# Altium project DMPro16.PrjPcb (part 3 of 3)
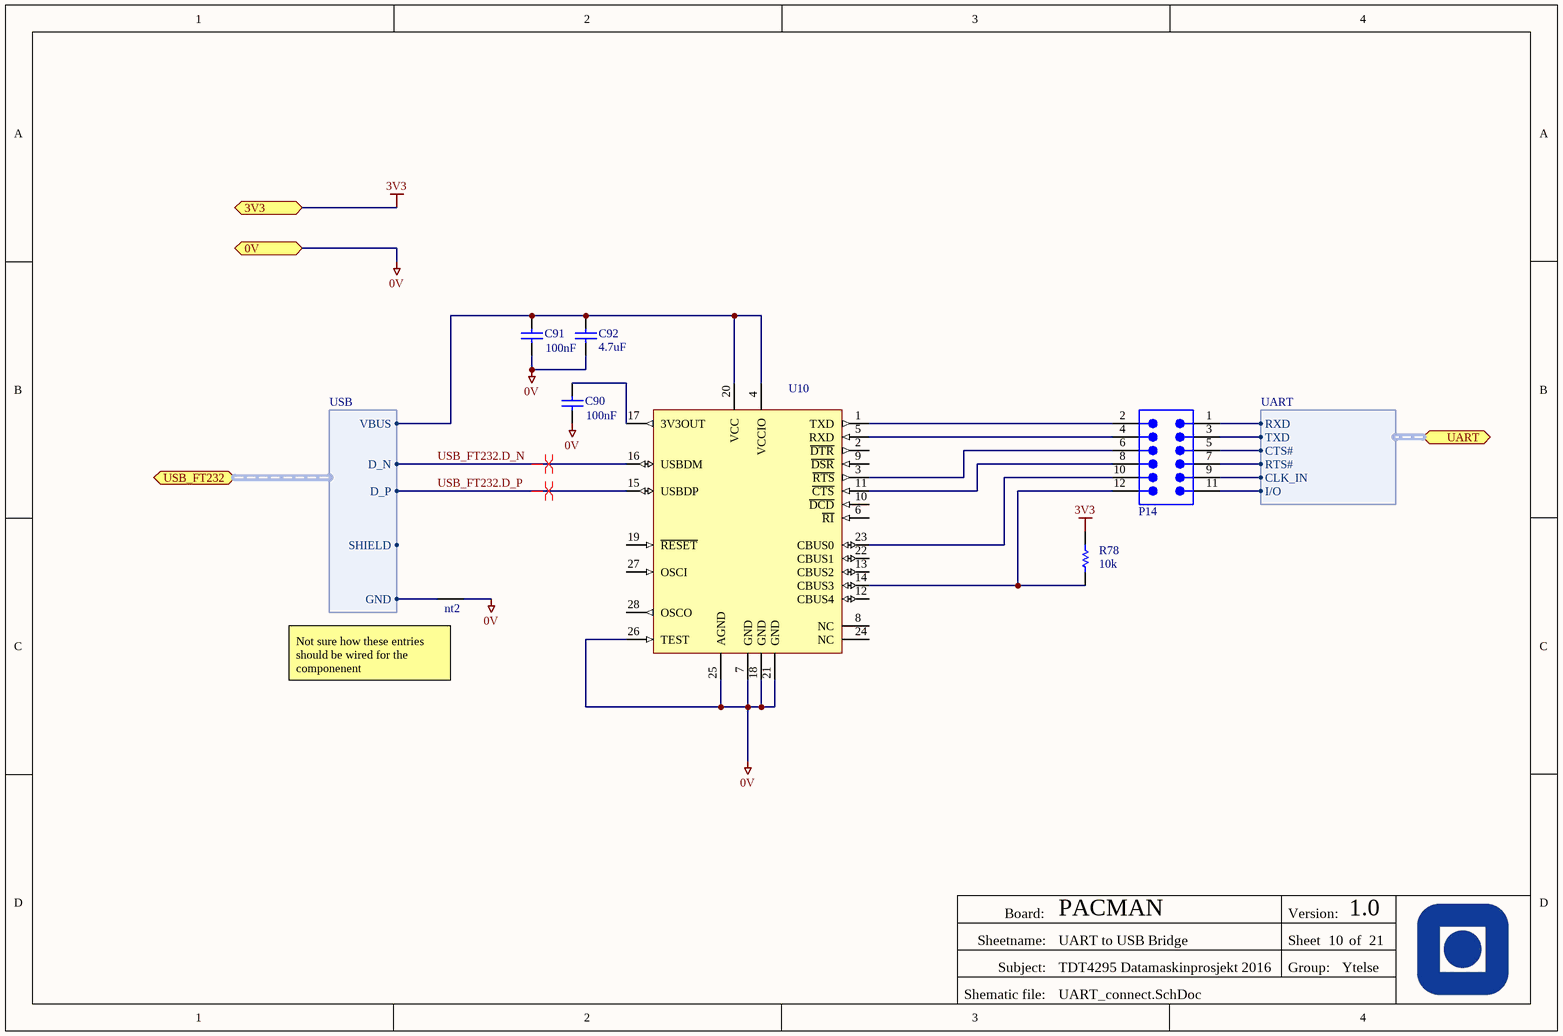
[diagram p21: UART_connect.SchDoc]

## Nets that join several sheets
0V: EFM32_power (24 pins), EFM32_IO (15 pins), XC7A35TFTG256_power (76 pins), XC7A35TFTG256_bank14 (C89.1 R59.2 SW4.1), XC7A35TFTG256_bank0 (19 pins), XC7A35TFTG256_bank15 (P13.11 P13.12), XC7A35TFTG256_bank35 (C41.1 C42.1 OSC3.2), SDtop (6 pins), Power (25 pins), N25Q128A13ESE40 (C17.1 U2.4), USB3300 (18 pins), LED (5 pins), Connectors (D5.2 J6.5 P7.1), USB_trans (C87.1 P20.2 U9.7), UART_connect (9 pins)
1V: XC7A35TFTG256_power (14 pins), Power (5 pins)
1V8: XC7A35TFTG256_power (12 pins), Power (5 pins)
3V3: EFM32_power (21 pins), EFM32_IO (C1.2 OSC1.1 OSC1.4 P1.1), XC7A35TFTG256_power (51 pins), XC7A35TFTG256_bank14 (R58.1 R73.2), XC7A35TFTG256_bank0 (13 pins), XC7A35TFTG256_bank35 (C41.2 OSC3.4), SDtop (9 pins), Power (5 pins), N25Q128A13ESE40 (6 pins), USB3300 (11 pins), LED (P21.3), USB_trans (C87.2 U9.1 U9.12 U9.14), UART_connect (R78.2)
5V_USB: Power (17 pins), Connectors (D5.5 J6.1 P7.2)
Config_QSPI.QSPI_CS: XC7A35TFTG256_bank14 (U8.L12), N25Q128A13ESE40 (P3.5)
Config_QSPI.QSPI_D0: XC7A35TFTG256_bank14 (U8.J13), N25Q128A13ESE40 (R18.2)
Config_QSPI.QSPI_D1: XC7A35TFTG256_bank14 (U8.J14), N25Q128A13ESE40 (R19.2)
Config_QSPI.QSPI_D2: XC7A35TFTG256_bank14 (U8.K15), N25Q128A13ESE40 (R21.2)
Config_QSPI.QSPI_D3: XC7A35TFTG256_bank14 (U8.K16), N25Q128A13ESE40 (R20.2)
Config_QSPI.QSPI_SCK: XC7A35TFTG256_bank0 (U8.E8), N25Q128A13ESE40 (P2.5)
EBI.A0: EFM32_IO (U1.J4), XC7A35TFTG256_bank15 (P11.1 U8.D9)
EBI.A1: EFM32_IO (U1.K3), XC7A35TFTG256_bank15 (P11.2 U8.E12)
EBI.A2: EFM32_IO (U1.L3), XC7A35TFTG256_bank15 (P11.3 U8.D13)
EBI.A3: EFM32_IO (U1.J7), XC7A35TFTG256_bank15 (P11.4 U8.C12)
EBI.A4: EFM32_IO (U1.J8), XC7A35TFTG256_bank15 (P11.5 U8.C14)
EBI.A5: EFM32_IO (U1.G10), XC7A35TFTG256_bank15 (P11.6 U8.A13)
EBI.A6: EFM32_IO (U1.G11), XC7A35TFTG256_bank15 (P11.7 U8.B14)
EBI.A7: EFM32_IO (U1.E9), XC7A35TFTG256_bank15 (P11.8 U8.A15)
EBI.A8: EFM32_IO (U1.E10), XC7A35TFTG256_bank15 (P12.1 U8.E11)
EBI.A9: EFM32_IO (U1.F10), XC7A35TFTG256_bank15 (P12.2 U8.E13)
EBI.A10: EFM32_IO (U1.E11), XC7A35TFTG256_bank15 (P12.3 U8.C11)
EBI.A11: EFM32_IO (U1.A9), XC7A35TFTG256_bank15 (P12.4 U8.C13)
EBI.A12: EFM32_IO (U1.B9), XC7A35TFTG256_bank15 (P12.5 U8.C16)
EBI.A13: EFM32_IO (U1.C9), XC7A35TFTG256_bank15 (P12.6 U8.A14)
EBI.A14: EFM32_IO (U1.D9), XC7A35TFTG256_bank15 (P12.7 U8.B15)
EBI.A15: EFM32_IO (U1.D10), XC7A35TFTG256_bank15 (P12.8 U8.B16)
EBI.CS0: EFM32_IO (U1.D6), XC7A35TFTG256_bank15 (P16.4 U8.G15)
EBI.CS1: EFM32_IO (U1.A5), XC7A35TFTG256_bank15 (P16.1 U8.J15)
EBI.D0: EFM32_IO (U1.B4), XC7A35TFTG256_bank15 (P11.9 U8.H13)
EBI.D1: EFM32_IO (U1.A4), XC7A35TFTG256_bank15 (P11.10 U8.H11)
EBI.D2: EFM32_IO (U1.C3), XC7A35TFTG256_bank15 (P11.11 U8.G14)
EBI.D3: EFM32_IO (U1.B3), XC7A35TFTG256_bank15 (P11.12 U8.F13)
EBI.D4: EFM32_IO (U1.A3), XC7A35TFTG256_bank15 (P11.13 U8.H16)
EBI.D5: EFM32_IO (U1.B2), XC7A35TFTG256_bank15 (P11.14 U8.D14)
EBI.D6: EFM32_IO (U1.A2), XC7A35TFTG256_bank15 (P11.15 U8.F15)
EBI.D7: EFM32_IO (U1.A1), XC7A35TFTG256_bank15 (P11.16 U8.E16)
EBI.D8: EFM32_IO (U1.B1), XC7A35TFTG256_bank15 (P12.9 U8.H12)
EBI.D9: EFM32_IO (U1.C2), XC7A35TFTG256_bank15 (P12.10 U8.G12)
EBI.D10: EFM32_IO (U1.C1), XC7A35TFTG256_bank15 (P12.11 U8.F12)
EBI.D11: EFM32_IO (U1.D2), XC7A35TFTG256_bank15 (P12.12 U8.F14)
EBI.D12: EFM32_IO (U1.D1), XC7A35TFTG256_bank15 (P12.13 U8.E15)
EBI.D13: EFM32_IO (U1.E3), XC7A35TFTG256_bank15 (P12.14 U8.D15)
EBI.D14: EFM32_IO (U1.E2), XC7A35TFTG256_bank15 (P12.15 U8.G16)
EBI.D15: EFM32_IO (U1.E1), XC7A35TFTG256_bank15 (P12.16 U8.D16)
EBI.REn: EFM32_IO (U1.A7), XC7A35TFTG256_bank15 (P16.3 U8.H14)
EBI.WEn: EFM32_IO (U1.B6), XC7A35TFTG256_bank15 (P16.2 U8.J16)
FPGA_USB1.D_N: Connectors (D4.1 J5.2), USB_trans (R60.1 R63.1)
FPGA_USB1.D_P: Connectors (D4.3 J5.3), USB_trans (R61.1 R62.1 R64.1)
FPGA_USB1_tranceiver.D+ reserve: XC7A35TFTG256_bank35 (U8.G4), USB_trans (R61.2)
FPGA_USB1_tranceiver.D- reserve: XC7A35TFTG256_bank35 (R65.1 U8.G5), USB_trans (R60.2)
FPGA_USB1_tranceiver.~{OE}: XC7A35TFTG256_bank35 (U8.G1), USB_trans (P20.4 U9.9)
FPGA_USB1_tranceiver.RCV: XC7A35TFTG256_bank35 (U8.H4), USB_trans (P19.2 U9.3)
FPGA_USB1_tranceiver.SOFTCON: XC7A35TFTG256_bank35 (U8.J5), USB_trans (P19.3 U9.6)
FPGA_USB1_tranceiver.SPEED: XC7A35TFTG256_bank35 (U8.H2), USB_trans (P20.3 U9.2)
FPGA_USB1_tranceiver.SUSPEND: XC7A35TFTG256_bank35 (U8.G2), USB_trans (P20.1 U9.8)
FPGA_USB1_tranceiver.VM: XC7A35TFTG256_bank35 (U8.H5), USB_trans (P19.1 U9.5)
FPGA_USB1_tranceiver.VP: XC7A35TFTG256_bank35 (U8.J4), USB_trans (P19.4 U9.4)
MCU_BRIDGE.B0: EFM32_IO (U1.H1), XC7A35TFTG256_bank15 (P13.10 U8.A8)
MCU_BRIDGE.B1: EFM32_IO (U1.J1), XC7A35TFTG256_bank15 (P13.9 U8.A9)
MCU_BRIDGE.B2: EFM32_IO (U1.K1), XC7A35TFTG256_bank15 (P13.8 U8.A10)
MCU_BRIDGE.B3: EFM32_IO (U1.L1), XC7A35TFTG256_bank15 (P13.7 U8.A12)
MCU_BRIDGE.B4: EFM32_IO (U1.L2), XC7A35TFTG256_bank15 (P13.6 U8.B9)
MCU_BRIDGE.B5: EFM32_IO (U1.J2), XC7A35TFTG256_bank15 (P13.5 U8.B10)
MCU_BRIDGE.B6: EFM32_IO (U1.K2), XC7A35TFTG256_bank15 (P13.4 U8.B12)
MCU_BRIDGE.B7: EFM32_IO (U1.H2), XC7A35TFTG256_bank15 (P13.3 U8.B11)
MCU_BRIDGE.B8: EFM32_IO (U1.J3), XC7A35TFTG256_bank15 (P13.2 U8.C9)
MCU_BRIDGE.B9: EFM32_IO (U1.H3), XC7A35TFTG256_bank15 (P13.1 U8.C8)
NetC5_2: EFM32_power (C5.2 U1.B8 U1.B10), Connectors (R66.2)
NetC29_2: USB3300 (C29.2 P6.1), Connectors (R68.2)
NetC91_2: Connectors (R76.2), UART_connect (C91.2 C92.2 U10.4 U10.20)
NetD2_1: EFM32_IO (R1.2), Connectors (D2.1 J3.2)
NetD2_3: EFM32_IO (R2.2), Connectors (D2.3 J3.3)
NetFPGA_LED0_1: XC7A35TFTG256_bank35 (U8.H1), LED (FPGA_LED0.1)
NetFPGA_LED1_1: XC7A35TFTG256_bank35 (U8.J3), LED (FPGA_LED1.1)
NetFPGA_LED2_1: XC7A35TFTG256_bank35 (U8.J1), LED (FPGA_LED2.1)
NetFPGA_LED3_1: XC7A35TFTG256_bank35 (U8.K1), LED (FPGA_LED3.1)
NetFPGA_LED4_1: XC7A35TFTG256_bank35 (U8.K3), LED (FPGA_LED4.1)
NetFPGA_LED5_1: XC7A35TFTG256_bank35 (U8.L2), LED (FPGA_LED5.1)
NetFPGA_LED6_1: XC7A35TFTG256_bank35 (U8.L3), LED (FPGA_LED6.1)
NetFPGA_LED7_1: XC7A35TFTG256_bank35 (U8.H3), LED (FPGA_LED7.1)
NetLED9_2: EFM32_IO (U1.J11), LED (LED9.2 P15.3)
NetLED10_2: EFM32_IO (U1.H9), LED (LED10.2 P15.2)
NetLED11_2: EFM32_IO (U1.H10), LED (LED11.2 P15.1)
NetLED12_2: EFM32_IO (U1.H11), LED (LED12.2 P15.4)
Netnt0_0: USB3300 (nt0.0), Connectors (R69.2)
Netnt1_0: EFM32_power (nt1.0), Connectors (R67.2)
Netnt2_0: Connectors (R77.2), UART_connect (nt2.0)
SD.CD: XC7A35TFTG256_bank34 (U8.M5), SDtop (P4.5 R43.1 SD1.10)
SD.SD_CLK: XC7A35TFTG256_bank34 (U8.P1), SDtop (P4.7 SD1.5)
SD.SD_CMD: XC7A35TFTG256_bank34 (U8.N2), SDtop (P4.6 R38.1 SD1.2)
SD.SD_DAT0: XC7A35TFTG256_bank34 (U8.P3), SDtop (P4.9 R39.1 SD1.7)
SD.SD_DAT1: XC7A35TFTG256_bank34 (U8.P4), SDtop (P4.10 R40.1 SD1.8)
SD.SD_DAT2: XC7A35TFTG256_bank34 (U8.M1), SDtop (P4.4 R41.1 SD1.9)
SD.SD_DAT3: XC7A35TFTG256_bank34 (U8.N1), SDtop (P4.3 R42.1 R44.2 SD1.1)
UART.RXD: EFM32_IO (U1.A6), UART_connect (P14.1)
UART.TXD: EFM32_IO (U1.B7), UART_connect (P14.3)
ULPI_bus.CLKOUT: XC7A35TFTG256_bank35 (U8.B5), USB3300 (P5.9 U7.14)
ULPI_bus.D0: XC7A35TFTG256_bank35 (U8.A4), USB3300 (P5.1 U7.24)
ULPI_bus.D1: XC7A35TFTG256_bank35 (U8.A5), USB3300 (P5.2 U7.23)
ULPI_bus.D2: XC7A35TFTG256_bank35 (U8.A2), USB3300 (P5.3 U7.22)
ULPI_bus.D3: XC7A35TFTG256_bank35 (U8.A3), USB3300 (P5.4 U7.21)
ULPI_bus.D4: XC7A35TFTG256_bank35 (U8.B4), USB3300 (P5.5 U7.20)
ULPI_bus.D5: XC7A35TFTG256_bank35 (U8.B2), USB3300 (P5.6 U7.19)
ULPI_bus.D6: XC7A35TFTG256_bank35 (U8.C2), USB3300 (P5.7 U7.18)
ULPI_bus.D7: XC7A35TFTG256_bank35 (U8.C1), USB3300 (P5.8 U7.17)
ULPI_bus.DIR: XC7A35TFTG256_bank35 (U8.C7), USB3300 (P5.11 U7.12)
ULPI_bus.NXT: XC7A35TFTG256_bank35 (U8.C6), USB3300 (P5.12 U7.11)
ULPI_bus.RESET: XC7A35TFTG256_bank35 (U8.D6), USB3300 (P5.13 U7.9)
ULPI_bus.STP: XC7A35TFTG256_bank35 (U8.C3), USB3300 (P5.10 U7.13)
USB2_HS.D_N: USB3300 (U7.8), Connectors (D3.1 J4.2)
USB2_HS.D_P: USB3300 (U7.7), Connectors (D3.3 J4.3)
USB_FT232.D_N: Connectors (D1.1 J7.2), UART_connect (U10.16)
USB_FT232.D_P: Connectors (D1.3 J7.3), UART_connect (U10.15)